# EAGLE design RPIV00 (EAGLE 7.4.0)
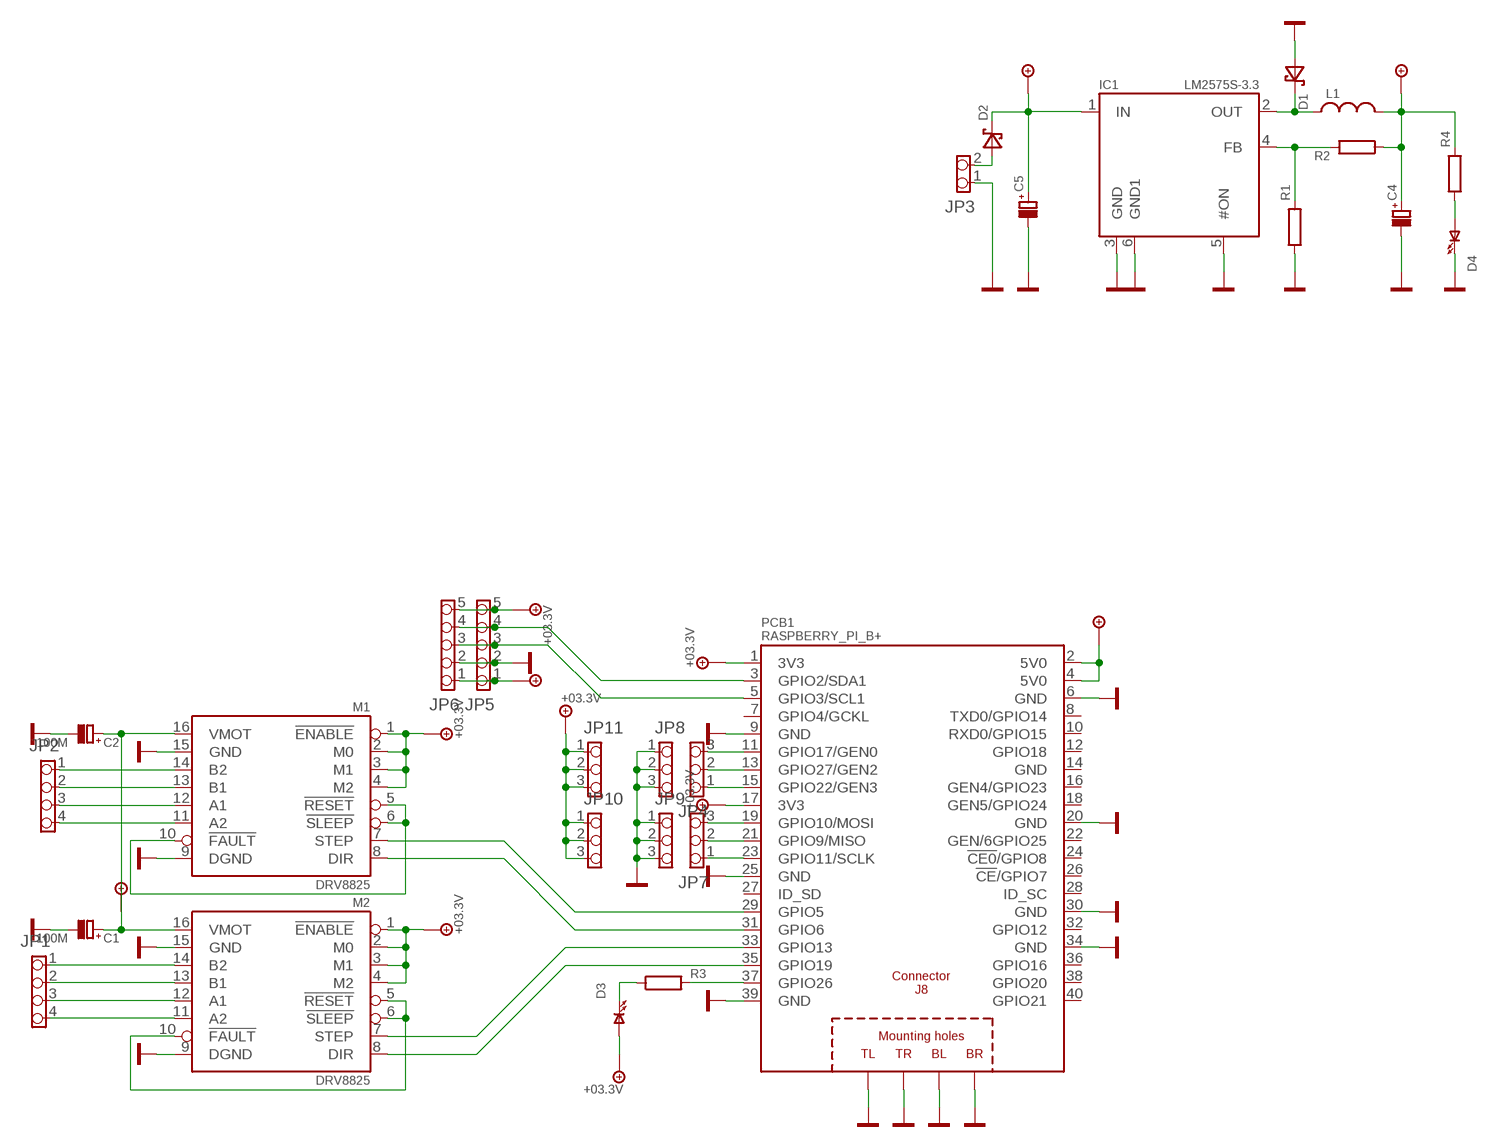
[diagram p0: schematic, sheet 1]

## Parts
C1  100M  CE_D10L13_L  [CE_D10L13_L]
C2  100M  CE_D10L13_L  [CE_D10L13_L]
C4  CE_D10L13_L  [CE_D10L13_L]
C5  CE_D10L13_R  [CE_D10L13_R]
D1  D_SCHOTKY_SMB  [D_SMB]
D2  D_SCHOTKY_SMB  [D_SMB]
D3  LED0805  [LED_0805]
D4  LED0805  [LED_0805]
IC1  LM2575S-3.3  [TO263-5]
JP1  PINHD-1X4  [1X04_254_M]
JP2  PINHD-1X4  [1X04_254_M]
JP3  PINHD-1X2_508_V  [1X02_508_V]
JP4  PINHD-1X3  [1X03_254_M]
JP5  PINHD-1X5  [1X05_254_M]
JP6  PINHD-1X5  [1X05_254_M]
JP7  PINHD-1X3  [1X03_254_M]
JP8  PINHD-1X3  [1X03_254_M]
JP9  PINHD-1X3  [1X03_254_M]
JP10  PINHD-1X3  [1X03_254_M]
JP11  PINHD-1X3  [1X03_254_M]
L1  L_DE1207  [DE1207]
M1  DRV8825  [MODULE_16P]
M2  DRV8825  [MODULE_16P]
PCB1  RASPBERRY_PI_B+  [RASPBERRY_PI_B+]
R1  R_R0805  [0805]
R2  R_R0805  [0805]
R3  R_R0805  [0805]
R4  R_R0805  [0805]

## Nets
+3.3V: D3.A JP5.5 JP6.5 JP10.1 JP10.2 JP10.3 JP11.1 JP11.2 JP11.3 M1.1(!ENABLE) M1.2(M0) M1.3(M1) M1.4(M2) M2.1(!ENABLE) M2.2(M0) M2.3(M1) M2.4(M2) PCB1.1(3V3) PCB1.17(3V3) ; supply symbol labelled +03.3V
+5V: C4.P(+) JP5.1 JP6.1 L1.1 PCB1.2(5V0) PCB1.4(5V0) R2.1 R4.2
+24V: C1.P(+) C2.P(+) C5.P(+) D2.K IC1.1(IN) M1.16(VMOT) M2.16(VMOT)
GND: C1.M(-) C2.M(-) C4.M(-) C5.M(-) D1.A D4.K(C) IC1.3(GND) IC1.5(#ON) IC1.6(GND1) JP3.1 JP5.2 JP6.2 JP8.1 JP8.2 JP8.3 JP9.1 JP9.2 JP9.3 M1.9(DGND) M1.15(GND) M2.9(DGND) M2.15(GND) PCB1.6(GND) PCB1.9(GND) PCB1.20(GND) PCB1.25(GND) PCB1.30(GND) PCB1.34(GND) PCB1.39(GND) PCB1.PE_BL(BL) PCB1.PE_BR(BR) PCB1.PE_TL(TL) PCB1.PE_TR(TR) R1.1
N$1: JP1.1 M2.14(B2)
N$2: JP1.2 M2.13(B1)
N$3: JP1.3 M2.12(A1)
N$4: JP1.4 M2.11(A2)
N$5: JP2.1 M1.14(B2)
N$6: JP2.2 M1.13(B1)
N$7: JP2.3 M1.12(A1)
N$8: JP2.4 M1.11(A2)
N$9: JP4.3 PCB1.11(GPIO17/GEN0)
N$11: M2.8(DIR) PCB1.35(GPIO19)
N$12: M2.7(STEP) PCB1.33(GPIO13)
N$13: M1.8(DIR) PCB1.31(GPIO6)
N$14: M1.7(STEP) PCB1.29(GPIO5)
N$15: JP4.2 PCB1.13(GPIO27/GEN2)
N$17: M2.5(!RESET) M2.6(!SLEEP) M2.10(!FAULT)
N$18: M1.5(!RESET) M1.6(!SLEEP) M1.10(!FAULT)
N$19: JP4.1 PCB1.15(GPIO22/GEN3)
N$20: JP7.3 PCB1.19(GPIO10/MOSI)
N$21: JP7.2 PCB1.21(GPIO9/MISO)
N$22: D1.K IC1.2(OUT) L1.2
N$23: IC1.4(FB) R1.2 R2.2
N$24: D2.A JP3.2
N$25: JP7.1 PCB1.23(GPIO11/SCLK)
N$27: PCB1.37(GPIO26) R3.2
N$28: D3.K(C) R3.1
N$29: D4.A R4.1
SCL: JP5.3 JP6.3 PCB1.5(GPIO3/SCL1)
SDA: JP5.4 JP6.4 PCB1.3(GPIO2/SDA1)
Unconnected: PCB1.7(GPIO4/GCKL) PCB1.8(TXD0/GPIO14) PCB1.10(RXD0/GPIO15) PCB1.12(GPIO18) PCB1.14(GND) PCB1.16(GEN4/GPIO23) PCB1.18(GEN5/GPIO24) PCB1.22(GEN/6GPIO25) PCB1.24(!CE0!/GPIO8) PCB1.26(!CE!/GPIO7) PCB1.27(ID_SD) PCB1.28(ID_SC) PCB1.32(GPIO12) PCB1.36(GPIO16) PCB1.38(GPIO20) PCB1.40(GPIO21)

## Library data of the parts
C1 C2 C4 C5 = !discrete:CE: Kondenzator Elektrolyt
D1 D2 = !diody:D_SCHOTKY: Dioda Schottkyho Typ Ur (Urpk] Uf I (Ipk] Pouzdro SD103B 30 V 200 mA DO35 BAT42 30 V 200 mA DO35 BAT43 30 V 200 mA DO35 BAT46 100 V 150 mA DO35 BAT47 20 V 350 mA DO35 BAT48 40 V 350 mA DO35 SK24 40 V (28V) 0.55V 2A (50A) DO214AA (SMB) SK26 60 V 0.65V 2A (50A) DO214AA (SMB)
D3 D4 = !opto:LED: Dioda LED
IC1 = !stab:LM2575S-*: Stabilizátor spínaný
JP1 JP2 = !pinhead:PINHD-1X4: Konektor 4 PIN Typ Rastr Imax Umax Rmax Kontakt 2.54 mm 500 mA 125 V 50 mOhm krimp /90 2.54 mm 500 mA 125 V 50 mOhm krimp _MX5267 2.50 mm 2.5 A 250 V 20 mOhm krimp _MX53048 1.25 mm 800 mA 125 V 20 mOhm krimp _PV-3.81 3.81 mm 8 A 130 V 30 mOhm ?roub
JP3 = !pinhead:PINHD-1X2: Konektor Typ Rastr Imax Umax Rmax Kontakt 2.54 mm 500 mA 125 V 50 mOhm krimp /90 2.54 mm 500 mA 125 V 50 mOhm krimp _MX5267 2.50 mm 2.5 A 250 V 20 mOhm krimp _MX53048 1.25 mm 800 mA 125 V 20 mOhm krimp _PV-3.81 3.81 mm 8 A 130 V 30 mOhm ?roub
JP4 JP7-JP11 = !pinhead:PINHD-1X3: Konektor 3 PIN Typ Rastr Imax Umax Rmax Kontakt 2.54 mm 500 mA 125 V 50 mOhm krimp /90 2.54 mm 500 mA 125 V 50 mOhm krimp _MX5267 2.50 mm 2.5 A 250 V 20 mOhm krimp _MX53048 1.25 mm 800 mA 125 V 20 mOhm krimp _PV-3.81 3.81 mm 8 A 130 V 30 mOhm ?roub
JP5 JP6 = !pinhead:PINHD-1X5: Konektor Typ Rastr Imax Umax Rmax Kontakt 2.54 mm 500 mA 125 V 50 mOhm krimp /90 2.54 mm 500 mA 125 V 50 mOhm krimp _MX5267 2.50 mm 2.5 A 250 V 20 mOhm krimp _MX53048 1.25 mm 800 mA 125 V 20 mOhm krimp _PV-3.81 3.81 mm 8 A 130 V 30 mOhm ?roub
L1 = !discrete:L: Indukcnost
M1 M2 = pololu:DRV8825
PCB1 = RASPBERRY_PI_Bplus:RASPBERRY_PI_B+: Raspberry Pi B+ Based on issue: Thursday, July 10, 2014 - Rev 1.2 LBR by Tim R. 07-2014
R1-R4 = !discrete:R_: Rezistor

## Board
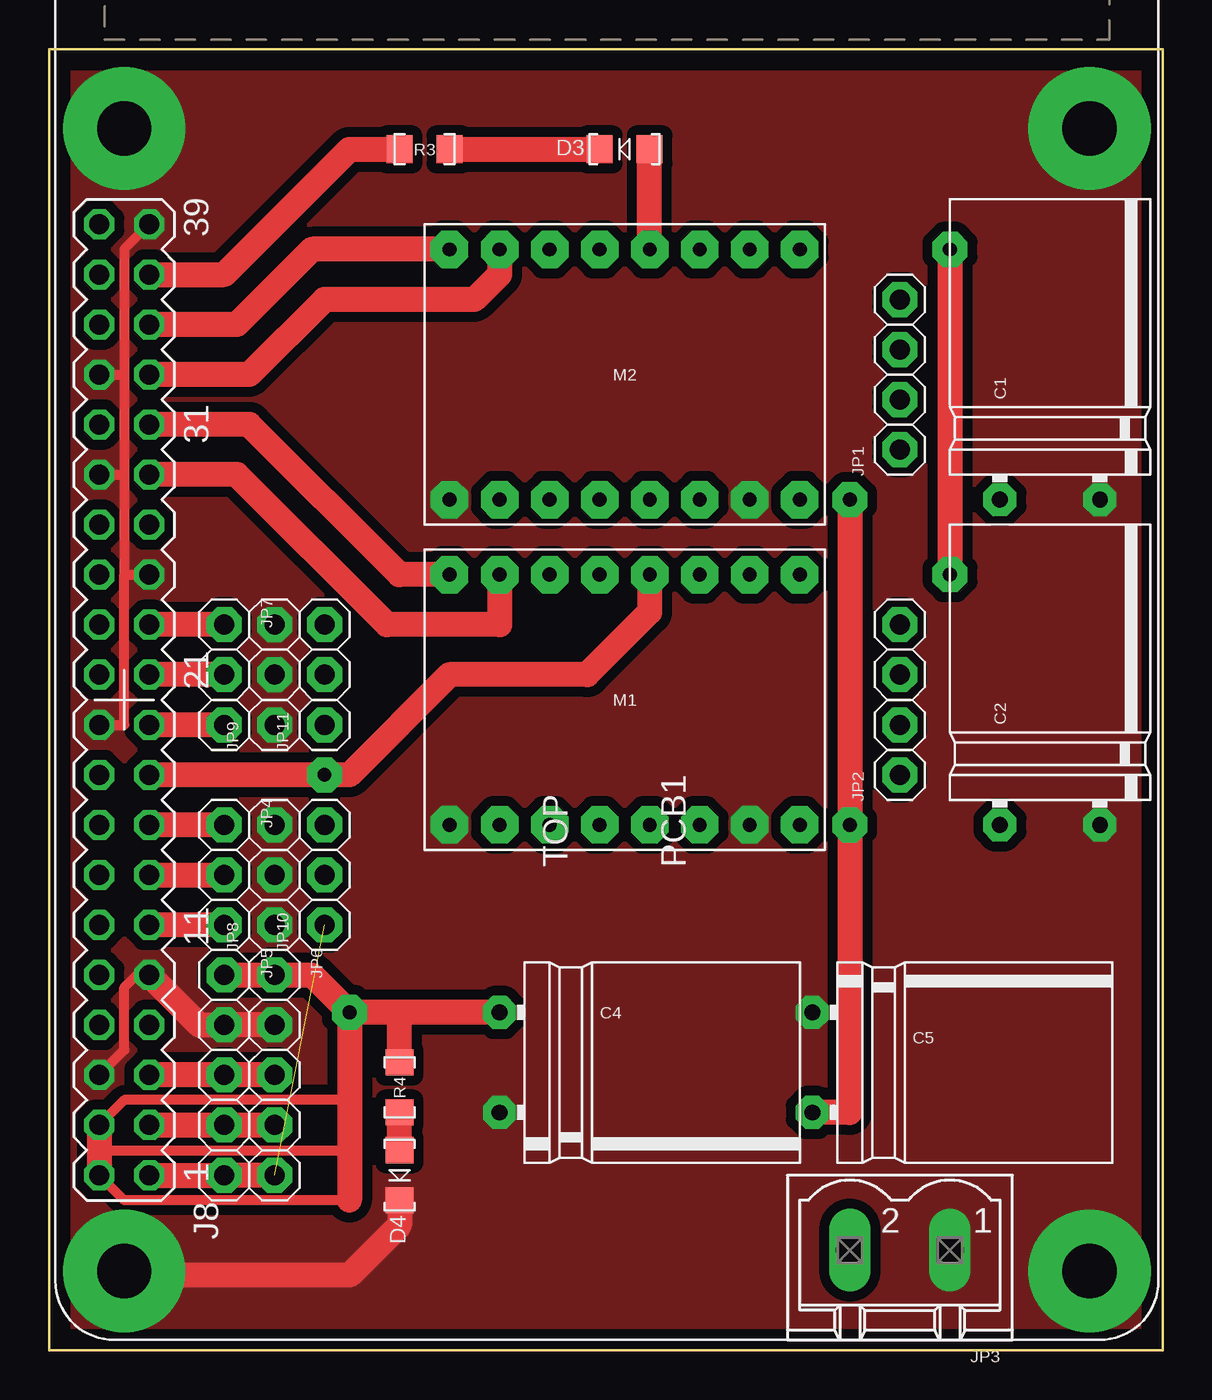
[diagram p1: board, top side]
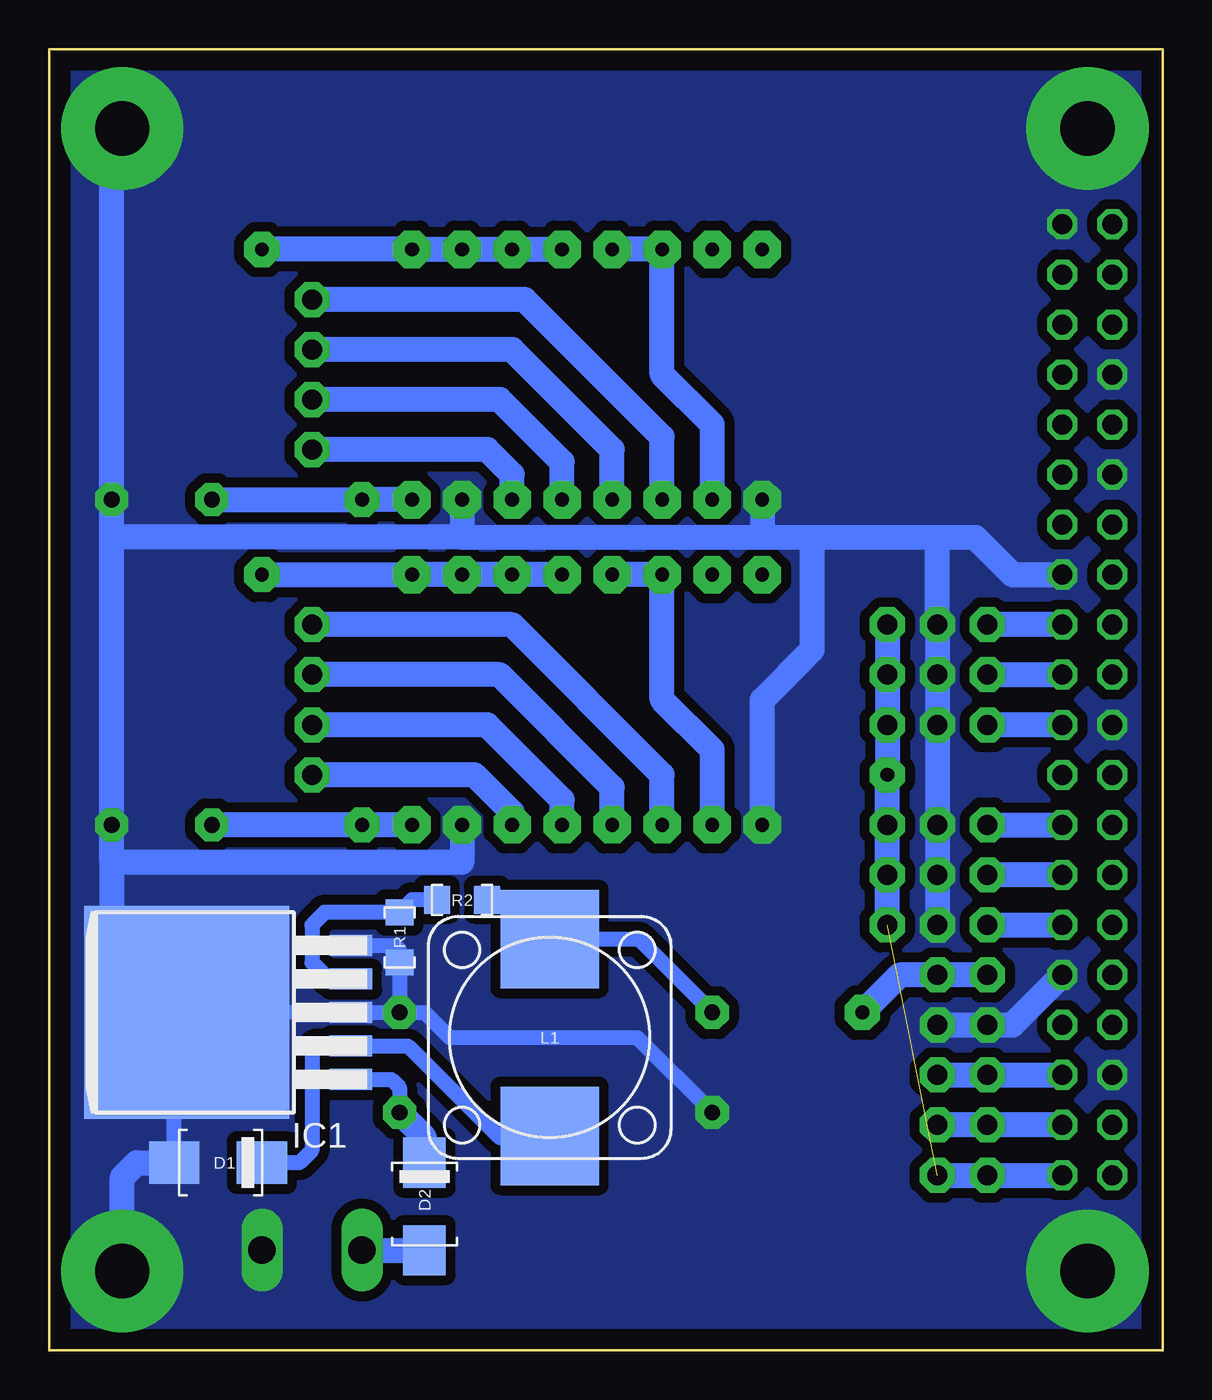
[diagram p2: board, bottom side, seen from below]

Size 56.52 x 66.04 mm. Coordinates in mm from the lower left corner, seen from the top.
Outline: 0,0 56.52,0 56.52,66.04 0,66.04 0,0
Copper layers (1*16): Top 0.035mm / dielectric 1.5mm / Bottom 0.035mm
Design rules "default": minimum track width 10mil, minimum drill 24mil, track to track 8mil, track to pad 8mil, pad to pad 8mil, via to via 8mil, smd to smd 8mil, copper to edge 40mil, drill to drill 8mil, minimum pad ring 10mil, minimum via ring 8mil, stop-mask expansion 4mil, vias tented up to drill 0mil, thermal gap 10mil

### Footprints (pad centres in the part's own frame; a part is rotated, then mirrored left to right if it is on the bottom)
CE_D10L13_L = drill 0.8 pad 1.676 octagon: M 0,2.54; P 0,-2.54
CE_D10L13_R = drill 0.8 pad 1.676 octagon: M 0,2.54; P 0,-2.54
D_SMB = smd 2.54 x 2.159: A 2.54,0; K -1.905,0
LED_0805 = smd 1.321 x 1.422: A -1.27,0; K 1.27,0
TO263-5 = smd 1.067 x 2.159: 1 -3.404,-5.791; 2 -1.702,-5.791; 3 0,-5.791; 4 1.702,-5.791; 5 3.404,-5.791 | smd 10.8 x 10.41: 6 0,2.54
1X04_254_M = drill 1.016 pad 1.778 octagon: 1 -3.81,0; 2 -1.27,0; 3 1.27,0; 4 3.81,0
1X02_508_V = drill 1.397 long: 1 -2.54,0; 2 2.54,0
1X03_254_M = drill 1.016 pad 1.778 octagon: 1 -2.54,0; 2 0,0; 3 2.54,0
1X05_254_M = drill 1.016 pad 1.778 octagon: 1 -5.08,0; 2 -2.54,0; 3 0,0; 4 2.54,0; 5 5.08,0
DE1207 = smd 5 x 5: 1 -5,0; 2 5,0
MODULE_16P = drill 0.7 pad 1.905 octagon: 1 -6.35,8.89; 2 -6.35,6.35; 3 -6.35,3.81; 4 -6.35,1.27; 5 -6.35,-1.27; 6 -6.35,-3.81; 7 -6.35,-6.35; 8 -6.35,-8.89; 9 6.35,-8.89; 10 6.35,-6.35; 11 6.35,-3.81; 12 6.35,-1.27; 13 6.35,1.27; 14 6.35,3.81; 15 6.35,6.35; 16 6.35,8.89
RASPBERRY_PI_B+ = drill 1.016 octagon: 1 -24.13,-1.27; 2 -24.13,1.27; 3 -21.59,-1.27; 4 -21.59,1.27; 5 -19.05,-1.27; 6 -19.05,1.27; 7 -16.51,-1.27; 8 -16.51,1.27; 9 -13.97,-1.27; 10 -13.97,1.27; 11 -11.43,-1.27; 12 -11.43,1.27; 13 -8.89,-1.27; 14 -8.89,1.27; 15 -6.35,-1.27; 16 -6.35,1.27; 17 -3.81,-1.27; 18 -3.81,1.27; 19 -1.27,-1.27; 20 -1.27,1.27; 21 1.27,-1.27; 22 1.27,1.27; 23 3.81,-1.27; 24 3.81,1.27; 25 6.35,-1.27; 26 6.35,1.27; 27 8.89,-1.27; 28 8.89,1.27; 29 11.43,-1.27; 30 11.43,1.27; 31 13.97,-1.27; 32 13.97,1.27; 33 16.51,-1.27; 34 16.51,1.27; 35 19.05,-1.27; 36 19.05,1.27; 37 21.59,-1.27; 38 21.59,1.27; 39 24.13,-1.27; 40 24.13,1.27 | drill 2.75 pad 6.2: PE_BL -29,-49; PE_BR 29,-49; PE_TL -29,0; PE_TR 29,0
0805 = smd 1.321 x 1.422: 1 -1.27,0; 2 1.27,0

### Placement (x,y rotation side)
C1  50.8,43.18 270 top
C2  50.8,26.67 270 top
C4  22.86,14.61 180 top
C5  38.73,14.61 0 top
D1  47.62,9.53 180 bottom
D2  37.47,7.62 270 bottom
D3  29.21,60.96 180 top
D4  17.78,8.89 270 top
IC1  46.99,17.14 90 bottom
JP1  43.18,49.53 90 top
JP2  43.18,33.02 90 top
JP3  43.18,5.08 180 top
JP4  8.89,24.13 270 top
JP5  8.89,13.97 270 top
JP6  11.43,13.97 270 top
JP7  8.89,34.29 270 top
JP8  11.43,24.13 90 top
JP9  11.43,34.29 90 top
JP10  13.97,24.13 90 top
JP11  13.97,34.29 90 top
L1  31.11,15.88 270 bottom
M1  29.21,33.02 270 top
M2  29.21,49.53 270 top
PCB1  3.81,33.02 90 top
R1  38.73,20.95 90 bottom
R2  35.56,22.86 180 bottom
R3  19.05,60.96 180 top
R4  17.78,13.34 90 top

### Tracks (layer width: path | path; a pad name or v marks a point on that pad's centre or on a via)
+3.3V  (via drill 0.7 pad 1.78)  (1 unrouted)
  Top 1.27: M1.4 30.48,37.47 27.3,34.29 20.32,34.29 15.24,29.21 v13.97,29.21 PCB1.17 | v45.72,55.88 v45.72,39.37 | JP6.5 JP5.5 PCB1.1 | M2.4 D3.A
  Bottom 1.27: M2.4 M2.3 M2.2 M2.1 v45.72,55.88 | M1.4 M1.3 M1.2 M1.1 v45.72,39.37 | JP6.5 JP5.5 PCB1.1 | JP10.1 JP10.2 JP10.3 v13.97,29.21 JP11.1 JP11.2 JP11.3
+5V  (via drill 0.7 pad 1.78)
  Top 0.508: 2.54,10.16 15.24,10.16 | 15.24,12.7 3.81,12.7 PCB1.4 | 15.24,7.62 3.81,7.62 PCB1.2
  Top 1.27: PCB1.4 2.54,10.16 PCB1.2 | 15.24,7.62 15.24,10.16 15.24,12.7 v15.24,17.14 | C4.P 17.78,17.14 | 17.78,17.14 v15.24,17.14 | JP5.1 JP6.1 13.34,19.05 v15.24,17.14 | R4.2 17.78,17.14
  Bottom 0.762: C4.P 26.59,20.88 L1.1 33.1,22.86 R2.1
  Bottom 1.27: JP5.1 JP6.1 13.34,19.05 v15.24,17.14
+24V  (via drill 0.7 pad 1.78)
  Top 1.27: v40.64,43.18 v40.64,26.67 40.64,12.06 C5.P
  Bottom 0.762: IC1.1 39.14,13.74 38.73,13.34 C5.P
  Bottom 1.27: M1.16 v40.64,26.67 C2.P | M2.16 v40.64,43.18 C1.P | D2.K 37.47,10.79 C5.P
GND
  Top 0.508: PCB1.6 3.81,15.24 3.81,18.41 4.45,19.05 PCB1.9 | PCB1.39 3.81,55.88 3.81,49.53 | 3.81,49.53 3.81,44.45 | 3.81,44.45 3.81,39.37 | 3.81,39.37 PCB1.25 | PCB1.30 3.81,44.45 | PCB1.34 3.81,49.53 | PCB1.20 3.81,31.75 3.81,39.37
  Top 1.27: PCB1.9 7.62,16.51 JP5.2 JP6.2 | D4.K 17.78,6.35 15.24,3.81 4.02,3.81 PCB1.PE_TL
  Bottom 0.762: C5.M IC1.3 IC1.6 50.16,16.51 D1.A | C5.M 37.47,17.14 36.2,15.88 26.67,15.88 C4.M | IC1.5 38.96,20.55 38.73,20.32 R1.1 C5.M
  Bottom 1.27: M1.15 35.56,24.77 53.34,24.77 | 35.56,41.27 53.34,41.27 | 53.34,41.27 C2.M 53.34,24.77 | PCB1.PE_BR 53.34,61.49 C1.M 53.34,41.27 | M2.15 35.56,41.27 | 35.56,41.27 20.32,41.27 | 20.32,41.27 17.78,41.27 | 17.78,41.27 11.43,41.27 | 11.43,41.27 9.53,41.27 7.62,39.37 PCB1.25 | M2.9 20.32,41.27 | M1.9 20.32,33.02 17.78,35.56 17.78,41.27 | JP6.2 JP5.2 7.62,16.51 PCB1.9 | PCB1.PE_BL 52.81,8.79 52.07,9.53 D1.A | 53.34,24.77 53.34,17.14 52.7,16.51 50.16,16.51 | JP8.1 JP8.2 JP8.3 JP9.1 JP9.2 JP9.3 11.43,41.27
  pour Bottom (isolate 0.508, no thermals): -0.64,66.67 57.15,66.67 57.15,-0.64 -0.64,-0.64
  pour Top (isolate 0.508, no thermals): -0.64,66.67 -0.64,-0.64 57.15,-0.64 57.15,66.67
N$1
  Bottom 1.27: M2.14 33.02,44.45 34.29,45.72 JP1.1
N$2
  Bottom 1.27: M2.13 30.48,45.09 33.66,48.26 JP1.2
N$3
  Bottom 1.27: M2.12 27.94,45.72 33.02,50.8 JP1.3
N$4
  Bottom 1.27: M2.11 25.4,46.35 32.38,53.34 JP1.4
N$5
  Bottom 1.27: M1.14 33.02,27.3 34.92,29.21 JP2.1
N$6
  Bottom 1.27: M1.13 30.48,27.94 34.29,31.75 JP2.2
N$7
  Bottom 1.27: M1.12 27.94,28.57 33.66,34.29 JP2.3
N$8
  Bottom 1.27: M1.11 25.4,29.21 33.02,36.83 JP2.4
N$9
  Top 1.27: JP4.3 PCB1.11
  Bottom 1.27: JP4.3 PCB1.11
N$11
  Top 1.27: M2.8 13.34,55.88 9.53,52.07 PCB1.35
N$12
  Top 1.27: M2.7 22.86,54.61 21.59,53.34 13.97,53.34 10.16,49.53 PCB1.33
N$13
  Top 1.27: M1.8 17.78,39.37 10.16,46.99 PCB1.31
N$14
  Top 1.27: M1.7 22.86,36.83 17.14,36.83 9.53,44.45 PCB1.29
N$15
  Top 1.27: PCB1.13 JP4.2
  Bottom 1.27: PCB1.13 JP4.2
N$17
  Bottom 1.27: M2.10 22.86,46.99 25.4,49.53 M2.6 M2.5
N$18
  Bottom 1.27: M1.10 22.86,30.48 25.4,33.02 M1.6 M1.5
N$19
  Top 1.27: JP4.1 PCB1.15
  Bottom 1.27: JP4.1 PCB1.15
N$20
  Top 1.27: JP7.3 PCB1.19
  Bottom 1.27: PCB1.19 JP7.3
N$21
  Top 1.27: JP7.2 PCB1.21
  Bottom 1.27: JP7.2 PCB1.21
N$22
  Bottom 0.762: D1.K 43.81,9.53 43.18,10.16 43.18,15.24 42.98,15.44 IC1.2 38.3,15.44 33.66,10.79 31.2,10.79 L1.2
N$23
  Bottom 0.762: R2.2 38.1,22.86 R1.2 42.55,22.23 43.18,21.59 43.18,19.68 42.34,18.85 IC1.4
N$24
  Bottom 1.27: JP3.2 D2.A
N$25
  Top 1.27: JP7.1 PCB1.23
  Bottom 1.27: PCB1.23 JP7.1
N$27
  Top 1.27: PCB1.37 8.89,54.61 15.24,60.96 R3.2
N$28
  Top 1.27: R3.1 D3.K
N$29
  Top 1.27: D4.A R4.1
SCL
  Top 1.27: JP6.3 JP5.3 PCB1.5
  Bottom 1.27: JP6.3 JP5.3 PCB1.5
SDA
  Top 1.27: PCB1.3 JP5.4 JP6.4
  Bottom 1.27: PCB1.3 JP5.4 JP6.4